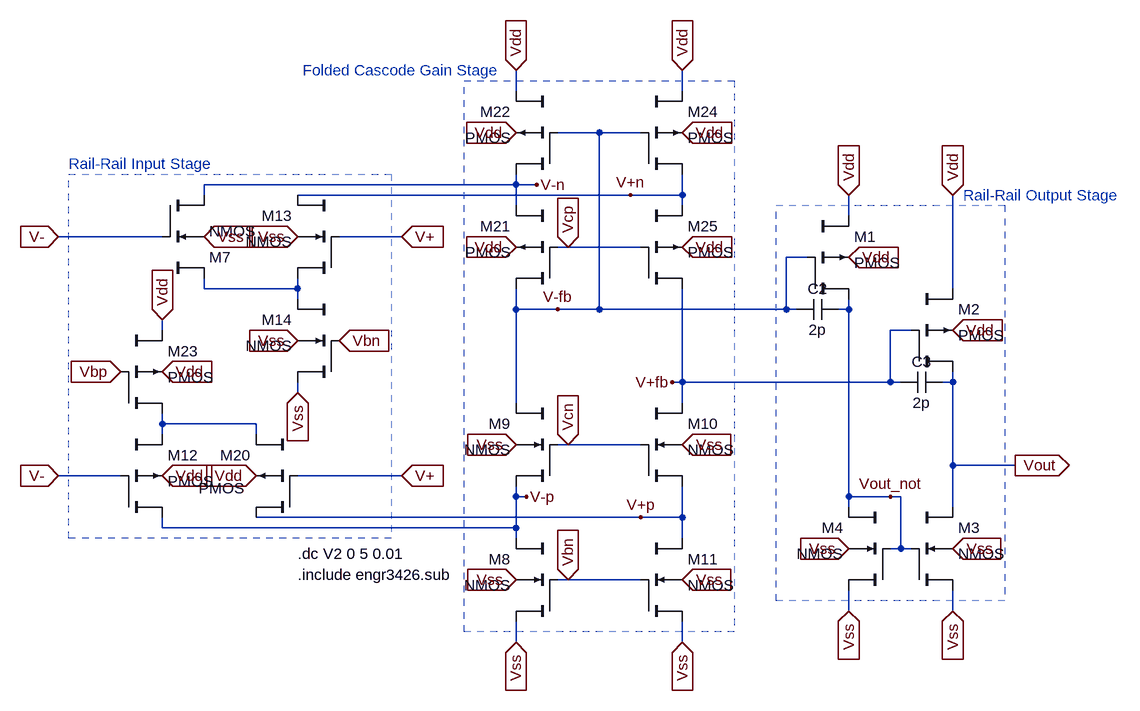
[diagram p0: schematic amp.asc]
amp.asc, the LTspice schematic file:
Version 4
SHEET 1 2380 680
WIRE 1040 -624 1040 -656
WIRE 1296 -624 1296 -656
WIRE 1168 -560 1104 -560
WIRE 1232 -560 1168 -560
WIRE 1040 -480 1040 -496
WIRE 1040 -480 560 -480
WIRE 1072 -480 1040 -480
WIRE 560 -464 560 -480
WIRE 1216 -464 704 -464
WIRE 1296 -464 1296 -496
WIRE 1296 -464 1216 -464
WIRE 1040 -448 1040 -480
WIRE 1296 -448 1296 -464
WIRE 1552 -432 1552 -464
WIRE 496 -400 336 -400
WIRE 864 -400 768 -400
WIRE 1120 -384 1104 -384
WIRE 1232 -384 1120 -384
WIRE 1488 -368 1456 -368
WIRE 560 -320 560 -336
WIRE 704 -320 704 -336
WIRE 704 -320 560 -320
WIRE 1712 -320 1712 -464
WIRE 704 -304 704 -320
WIRE 1040 -288 1040 -320
WIRE 1104 -288 1040 -288
WIRE 1168 -288 1168 -560
WIRE 1168 -288 1104 -288
WIRE 1456 -288 1456 -368
WIRE 1456 -288 1168 -288
WIRE 1472 -288 1456 -288
WIRE 1552 -288 1552 -304
WIRE 1552 -288 1536 -288
WIRE 496 -256 496 -272
WIRE 1648 -256 1616 -256
WIRE 1296 -176 1296 -320
WIRE 1296 -176 1280 -176
WIRE 1616 -176 1616 -256
WIRE 1616 -176 1296 -176
WIRE 1632 -176 1616 -176
WIRE 1712 -176 1712 -192
WIRE 1712 -176 1696 -176
WIRE 704 -160 704 -176
WIRE 1040 -144 1040 -288
WIRE 1296 -144 1296 -176
WIRE 496 -112 496 -128
WIRE 640 -112 496 -112
WIRE 496 -96 496 -112
WIRE 640 -96 640 -112
WIRE 1120 -80 1104 -80
WIRE 1232 -80 1120 -80
WIRE 1712 -48 1712 -176
WIRE 1808 -48 1712 -48
WIRE 432 -32 336 -32
WIRE 864 -32 704 -32
WIRE 1040 0 1040 -16
WIRE 1056 0 1040 0
WIRE 1552 0 1552 -288
WIRE 1616 0 1552 0
WIRE 1632 0 1616 0
WIRE 1552 16 1552 0
WIRE 1712 16 1712 -48
WIRE 1232 32 640 32
WIRE 1296 32 1296 -16
WIRE 1296 32 1232 32
WIRE 496 48 496 32
WIRE 1040 48 1040 0
WIRE 1040 48 496 48
WIRE 1040 64 1040 48
WIRE 1296 64 1296 32
WIRE 1632 80 1632 0
WIRE 1632 80 1616 80
WIRE 1648 80 1632 80
WIRE 1120 128 1104 128
WIRE 1232 128 1120 128
WIRE 1552 176 1552 144
WIRE 1712 176 1712 144
WIRE 1040 224 1040 192
WIRE 1296 224 1296 192
FLAG 432 -192 Vbp
IOPIN 432 -192 In
FLAG 336 -32 V-
IOPIN 336 -32 In
FLAG 1120 128 Vbn
IOPIN 1120 128 In
FLAG 1120 -80 Vcn
IOPIN 1120 -80 In
FLAG 1120 -384 Vcp
IOPIN 1120 -384 In
FLAG 496 -272 Vdd
IOPIN 496 -272 In
FLAG 496 -192 Vdd
IOPIN 496 -192 In
FLAG 496 -32 Vdd
IOPIN 496 -32 In
FLAG 640 -32 Vdd
IOPIN 640 -32 In
FLAG 1040 -384 Vdd
IOPIN 1040 -384 In
FLAG 1040 -560 Vdd
IOPIN 1040 -560 In
FLAG 1040 -656 Vdd
IOPIN 1040 -656 In
FLAG 1296 -656 Vdd
IOPIN 1296 -656 In
FLAG 1296 -560 Vdd
IOPIN 1296 -560 In
FLAG 1296 -384 Vdd
IOPIN 1296 -384 In
FLAG 1040 -80 Vss
IOPIN 1040 -80 In
FLAG 1296 -80 Vss
IOPIN 1296 -80 In
FLAG 1040 128 Vss
IOPIN 1040 128 In
FLAG 1296 128 Vss
IOPIN 1296 128 In
FLAG 1040 224 Vss
IOPIN 1040 224 In
FLAG 1296 224 Vss
IOPIN 1296 224 In
FLAG 1552 80 Vss
IOPIN 1552 80 In
FLAG 1712 80 Vss
IOPIN 1712 80 In
FLAG 1552 176 Vss
IOPIN 1552 176 In
FLAG 1712 176 Vss
IOPIN 1712 176 In
FLAG 1552 -464 Vdd
IOPIN 1552 -464 In
FLAG 1552 -368 Vdd
IOPIN 1552 -368 In
FLAG 1712 -464 Vdd
IOPIN 1712 -464 In
FLAG 1712 -256 Vdd
IOPIN 1712 -256 In
FLAG 768 -240 Vbn
IOPIN 768 -240 In
FLAG 704 -240 Vss
IOPIN 704 -240 In
FLAG 560 -400 Vss
IOPIN 560 -400 In
FLAG 704 -400 Vss
IOPIN 704 -400 In
FLAG 704 -160 Vss
IOPIN 704 -160 In
FLAG 336 -400 V-
IOPIN 336 -400 In
FLAG 864 -32 V+
IOPIN 864 -32 In
FLAG 864 -400 V+
IOPIN 864 -400 In
FLAG 1808 -48 Vout
IOPIN 1808 -48 Out
FLAG 1104 -288 V-fb
FLAG 1280 -176 V+fb
FLAG 1056 0 V-p
FLAG 1232 32 V+p
FLAG 1616 0 Vout_not
FLAG 1072 -480 V-n
FLAG 1216 -464 V+n
SYMBOL cktsym\\nmos4 1040 128 M0
SYMATTR InstName M8
SYMATTR Value2 l=1.8u w=36u
SYMBOL cktsym\\nmos4 1040 -80 M0
SYMATTR InstName M9
SYMATTR Value2 l=1.8u w=36u
SYMBOL cktsym\\nmos4 1296 -80 R0
SYMATTR InstName M10
SYMATTR Value2 l=1.8u w=36u
SYMBOL cktsym\\nmos4 1296 128 R0
SYMATTR InstName M11
SYMATTR Value2 l=1.8u w=36u
SYMBOL cktsym\\pmos4 496 -32 R0
SYMATTR InstName M12
SYMATTR Value2 l=1.8u w=36u
SYMBOL cktsym\\pmos4 640 -32 M0
WINDOW 3 18 19 Left 2
SYMATTR InstName M20
SYMATTR Value2 l=1.8u w=36u
SYMBOL cktsym\\pmos4 1040 -384 M0
SYMATTR InstName M21
SYMATTR Value2 l=1.8u w=36u
SYMBOL cktsym\\pmos4 1040 -560 M0
SYMATTR InstName M22
SYMATTR Value2 l=1.8u w=36u
SYMBOL cktsym\\pmos4 496 -192 R0
SYMATTR InstName M23
SYMATTR Value2 l=1.8u w=36u
SYMBOL cktsym\\pmos4 1296 -560 R0
SYMATTR InstName M24
SYMATTR Value2 l=1.8u w=36u
SYMBOL cktsym\\pmos4 1296 -384 R0
SYMATTR InstName M25
SYMATTR Value2 l=1.8u w=36u
SYMBOL cktsym\\pmos4 1552 -368 R0
SYMATTR InstName M1
SYMATTR Value2 l=1.8u w=72u m=50
SYMBOL cktsym\\pmos4 1712 -256 R0
SYMATTR InstName M2
SYMATTR Value2 l=1.8u w=72u m=50
SYMBOL cktsym\\nmos4 1712 80 R0
SYMATTR InstName M3
SYMATTR Value2 l=1.8u w=72u m=50
SYMBOL cktsym\\nmos4 1552 80 M0
SYMATTR InstName M4
SYMATTR Value2 l=1.8u w=72u m=50
SYMBOL cap 1472 -272 R270
WINDOW 0 32 32 VTop 2
WINDOW 3 0 32 VBottom 2
SYMATTR InstName C2
SYMATTR Value 2p
SYMBOL cap 1632 -160 R270
WINDOW 0 32 32 VTop 2
WINDOW 3 0 32 VBottom 2
SYMATTR InstName C3
SYMATTR Value 2p
SYMBOL cktsym\\nmos4 560 -400 M180
SYMATTR InstName M7
SYMATTR Value2 l=1.8u w=36u
SYMBOL cktsym\\nmos4 704 -400 M0
SYMATTR InstName M13
SYMATTR Value2 l=1.8u w=36u
SYMBOL cktsym\\nmos4 704 -240 M0
SYMATTR InstName M14
SYMATTR Value2 l=1.8u w=36u
TEXT 704 120 Left 2 !.include engr3426.sub
TEXT 704 88 Left 2 !.dc V2 0 5 0.01
TEXT 352 -512 Left 2 ;Rail-Rail Input Stage
TEXT 712 -656 Left 2 ;Folded Cascode Gain Stage
TEXT 1728 -464 Left 2 ;Rail-Rail Output Stage
RECTANGLE Normal 848 64 352 -496 2
RECTANGLE Normal 1376 208 960 -640 2
RECTANGLE Normal 1792 160 1440 -448 2

The netlist it stands for:
* amp.asc
M8 V-p Vbn Vss Vss NMOS l=1.8u w=36u
M9 V-fb Vcn V-p Vss NMOS l=1.8u w=36u
M10 V+fb Vcn V+p Vss NMOS l=1.8u w=36u
M11 V+p Vbn Vss Vss NMOS l=1.8u w=36u
M12 V-p V- N002 Vdd PMOS l=1.8u w=36u
M20 V+p V+ N002 Vdd PMOS l=1.8u w=36u
M21 V-fb Vcp V-n Vdd PMOS l=1.8u w=36u
M22 V-n V-fb Vdd Vdd PMOS l=1.8u w=36u
M23 N002 Vbp Vdd Vdd PMOS l=1.8u w=36u
M24 V+n V-fb Vdd Vdd PMOS l=1.8u w=36u
M25 V+fb Vcp V+n Vdd PMOS l=1.8u w=36u
M1 Vout_not V-fb Vdd Vdd PMOS l=1.8u w=72u m=50
M2 Vout V+fb Vdd Vdd PMOS l=1.8u w=72u m=50
M3 Vout Vout_not Vss Vss NMOS l=1.8u w=72u m=50
M4 Vout_not Vout_not Vss Vss NMOS l=1.8u w=72u m=50
C2 V-fb Vout_not 2p
C3 V+fb Vout 2p
M7 N001 V- V-n Vss NMOS l=1.8u w=36u
M13 V+n V+ N001 Vss NMOS l=1.8u w=36u
M14 N001 Vbn Vss Vss NMOS l=1.8u w=36u
.model NMOS NMOS
.model PMOS PMOS
.lib standard.mos
.include engr3426.sub
.dc V2 0 5 0.01
* Rail-Rail Input Stage
* Folded Cascode Gain Stage
* Rail-Rail Output Stage
.backanno
.end